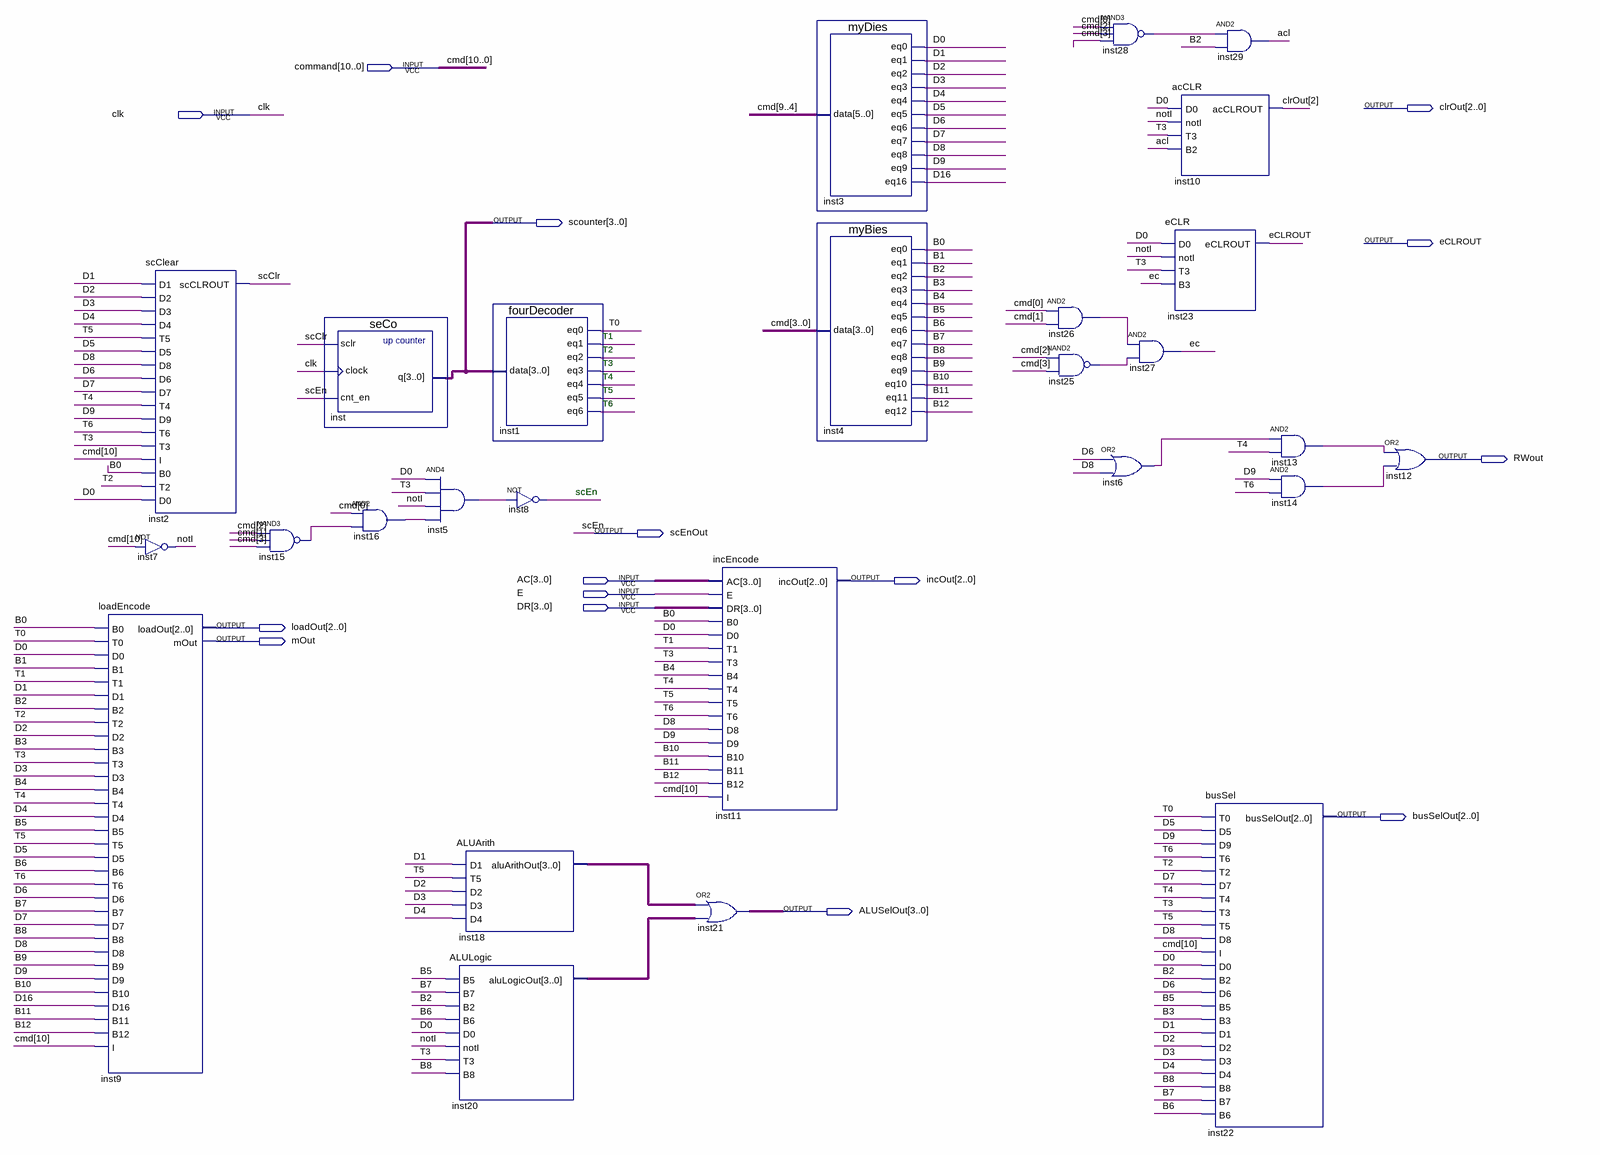
[diagram p0: schematic sheet]
// Quartus schematic cpuOguz.bdf as structural Verilog: 27 symbols, 15 pins
module cpuOguz (
  input  [10:0] command,
  input  clk,
  input  [3:0] AC,
  input  E,
  input  [3:0] DR,
  output [2:0] clrOut,
  output [3:0] scounter,
  output eCLROUT,
  output RWout,
  output scEnOut,
  output [2:0] incOut,
  output [2:0] loadOut,
  output mOut,
  output [2:0] busSelOut,
  output [3:0] ALUSelOut
);

  wire acl, B0, B1, B2, B3, B4, B5, B6, B7, B8, B9, B10, B11, B12, D0, D1, D2, D3, D4, D5, D6, D7, D8, D9,
       D16, ec, inst5_out, inst6_out, inst13_out, inst14_out, inst15_out, inst16_out, inst25_out, inst26_out,
       inst28_out, notI, scClr, T0, T1, T2, T3, T4, T5, T6;
  wire [3:0] inst18_aluarithout, inst20_alulogicout;

  loadEncode inst9 (
    .B0(B0), .T0(T0), .D0(D0), .B1(B1), .T1(T1), .D1(D1), .B2(B2), .T2(T2), .D2(D2), .B3(B3), .T3(T3),
    .D3(D3), .B4(B4), .T4(T4), .D4(D4), .B5(B5), .T5(T5), .D5(D5), .B6(B6), .T6(T6), .D6(D6), .B7(B7),
    .D7(D7), .B8(B8), .D8(D8), .B9(B9), .D9(D9), .B10(B10), .D16(D16), .B11(B11), .B12(B12), .I(command[10]),
    .loadOut(loadOut), .mOut(mOut));
  scClear inst2 (
    .D1(D1), .D2(D2), .D3(D3), .D4(D4), .T5(T5), .D5(D5), .D8(D8), .D6(D6), .D7(D7), .T4(T4), .D9(D9),
    .T6(T6), .T3(T3), .I(command[10]), .B0(B0), .T2(T2), .D0(D0), .scCLROUT(scClr));
  not inst7 (notI, command[10]);
  nand inst15 (inst15_out, command[2], command[1], command[3]);
  seCo inst (.sclr(scClr), .clock(clk), .cnt_en(scEnOut), .q(scounter));
  and inst16 (inst16_out, command[0], inst15_out);
  and inst5 (inst5_out, D0, T3, notI, inst16_out);
  ALUArith inst18 (.D1(D1), .T5(T5), .D2(D2), .D3(D3), .D4(D4), .aluArithOut(inst18_aluarithout));
  ALULogic inst20 (
    .B5(B5), .B7(B7), .B2(B2), .B6(B6), .D0(D0), .notI(notI), .T3(T3), .B8(B8),
    .aluLogicOut(inst20_alulogicout));
  fourDecoder inst1 (.data(scounter), .eq0(T0), .eq1(T1), .eq2(T2), .eq3(T3), .eq4(T4), .eq5(T5), .eq6(T6));
  not inst8 (scEnOut, inst5_out);
  assign ALUSelOut = inst18_aluarithout | inst20_alulogicout;  // OR2 inst21, 4 bits wide
  incEncode inst11 (
    .AC(AC), .E(E), .DR(DR), .B0(B0), .D0(D0), .T1(T1), .T3(T3), .B4(B4), .T4(T4), .T5(T5), .T6(T6), .D8(D8),
    .D9(D9), .B10(B10), .B11(B11), .B12(B12), .I(command[10]), .incOut(incOut));
  myDies inst3 (
    .data(command[9:4]), .eq0(D0), .eq1(D1), .eq2(D2), .eq3(D3), .eq4(D4), .eq5(D5), .eq6(D6), .eq7(D7),
    .eq8(D8), .eq9(D9), .eq16(D16));
  myBies inst4 (
    .data(command[3:0]), .eq0(B0), .eq1(B1), .eq2(B2), .eq3(B3), .eq4(B4), .eq5(B5), .eq6(B6), .eq7(B7),
    .eq8(B8), .eq9(B9), .eq10(B10), .eq11(B11), .eq12(B12));
  and inst26 (inst26_out, command[0], command[1]);
  nand inst25 (inst25_out, command[2], command[3]);
  nand inst28 (inst28_out, command[0], command[2], command[3]);
  and inst27 (ec, inst26_out, inst25_out);
  or inst6 (inst6_out, D6, D8);
  acCLR inst10 (.D0(D0), .notI(notI), .T3(T3), .B2(acl), .acCLROUT(clrOut[2]));
  eCLR inst23 (.D0(D0), .notI(notI), .T3(T3), .B3(ec), .eCLROUT(eCLROUT));
  and inst29 (acl, inst28_out, B2);
  busSel inst22 (
    .T0(T0), .D5(D5), .D9(D9), .T6(T6), .T2(T2), .D7(D7), .T4(T4), .T3(T3), .T5(T5), .D8(D8),
    .I(command[10]), .D0(D0), .B2(B2), .D6(D6), .B5(B5), .B3(B3), .D1(D1), .D2(D2), .D3(D3), .D4(D4),
    .B8(B8), .B7(B7), .B6(B6), .busSelOut(busSelOut));
  and inst13 (inst13_out, inst6_out, T4);
  and inst14 (inst14_out, D9, T6);
  or inst12 (RWout, inst13_out, inst14_out);

  // Other names for the same wires on the sheet: cmd[10:0] = command; scEn = scEnOut

  // Notes on the sheet:
  //   T1
  //   T2
  //   T3
  //   T4
  //   T5
  //   T6
  //   scEn
endmodule
